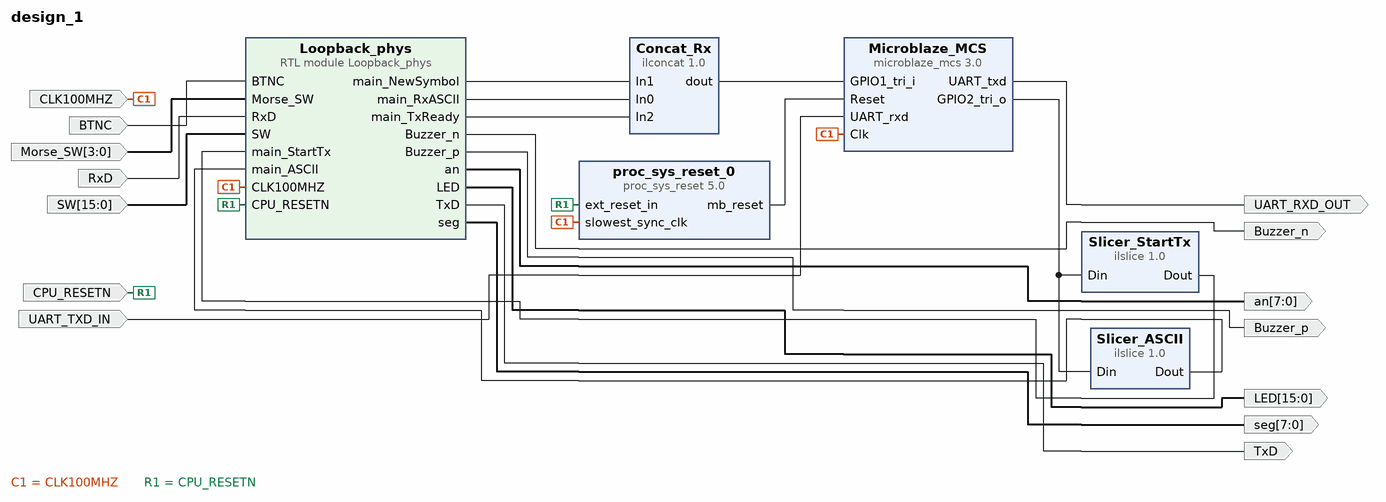
[diagram p0: block diagram of the top level]
# Vivado block design design_1, xc7a50ticsg324-1L, Vivado 2025.1
create_bd_design design_1

create_bd_port -dir I -type rst CPU_RESETN
set_property -dict {CONFIG.POLARITY ACTIVE_LOW} [get_bd_ports CPU_RESETN]
create_bd_port -dir I RxD
create_bd_port -dir O TxD
create_bd_port -dir I BTNC
create_bd_port -dir O Buzzer_p
create_bd_port -dir O Buzzer_n
create_bd_port -dir O -from 15 -to 0 LED
create_bd_port -dir O -from 7 -to 0 seg
create_bd_port -dir O -from 7 -to 0 an
create_bd_port -dir I -from 15 -to 0 SW
create_bd_port -dir I -from 3 -to 0 Morse_SW
create_bd_port -dir I UART_TXD_IN
create_bd_port -dir O UART_RXD_OUT
create_bd_port -dir I -type clk CLK100MHZ
set_property -dict {CONFIG.FREQ_HZ 100000000} [get_bd_ports CLK100MHZ]

create_bd_cell -type ip -vlnv xilinx.com:ip:microblaze_mcs:3.0 Microblaze_MCS
set_property -dict [list \
  CONFIG.GPI1_SIZE 10 \
  CONFIG.GPO2_SIZE 9 \
  CONFIG.MEMSIZE 131072 \
  CONFIG.RESET_BOARD_INTERFACE Custom \
  CONFIG.UART_BAUDRATE 115200 \
  CONFIG.UART_BOARD_INTERFACE Custom \
  CONFIG.USE_BOARD_FLOW true \
  CONFIG.USE_GPI1 1 \
  CONFIG.USE_GPI2 0 \
  CONFIG.USE_GPO1 0 \
  CONFIG.USE_GPO2 1 \
] [get_bd_cells Microblaze_MCS]
create_bd_cell -type module -reference Loopback_phys Loopback_phys
create_bd_cell -type inline_hdl -vlnv xilinx.com:inline_hdl:ilconcat:1.0 Concat_Rx
set_property -dict {CONFIG.IN0_WIDTH 8 CONFIG.NUM_PORTS 3} [get_bd_cells Concat_Rx]
create_bd_cell -type inline_hdl -vlnv xilinx.com:inline_hdl:ilslice:1.0 Slicer_StartTx
set_property -dict {CONFIG.DIN_TO 8 CONFIG.DIN_WIDTH 9} [get_bd_cells Slicer_StartTx]
create_bd_cell -type inline_hdl -vlnv xilinx.com:inline_hdl:ilslice:1.0 Slicer_ASCII
set_property -dict {CONFIG.DIN_FROM 7 CONFIG.DIN_WIDTH 9} [get_bd_cells Slicer_ASCII]
create_bd_cell -type ip -vlnv xilinx.com:ip:proc_sys_reset:5.0 proc_sys_reset_0
set_property -dict {CONFIG.RESET_BOARD_INTERFACE Custom CONFIG.USE_BOARD_FLOW true} [get_bd_cells proc_sys_reset_0]

# ---- connections ----

connect_bd_net [get_bd_ports BTNC] [get_bd_pins Loopback_phys/BTNC]
connect_bd_net [get_bd_ports CLK100MHZ] \
  [get_bd_pins proc_sys_reset_0/slowest_sync_clk] [get_bd_pins Microblaze_MCS/Clk] [get_bd_pins Loopback_phys/CLK100MHZ]
connect_bd_net [get_bd_ports CPU_RESETN] [get_bd_pins proc_sys_reset_0/ext_reset_in] [get_bd_pins Loopback_phys/CPU_RESETN]
connect_bd_net -net Loopback_phys_0_main_NewSymbol [get_bd_pins Loopback_phys/main_NewSymbol] [get_bd_pins Concat_Rx/In1]
connect_bd_net [get_bd_pins Loopback_phys/Buzzer_n] [get_bd_ports Buzzer_n]
connect_bd_net [get_bd_pins Loopback_phys/Buzzer_p] [get_bd_ports Buzzer_p]
connect_bd_net [get_bd_pins Loopback_phys/LED] [get_bd_ports LED]
connect_bd_net [get_bd_pins Loopback_phys/TxD] [get_bd_ports TxD]
connect_bd_net [get_bd_pins Loopback_phys/an] [get_bd_ports an]
connect_bd_net [get_bd_pins Loopback_phys/main_RxASCII] [get_bd_pins Concat_Rx/In0]
connect_bd_net [get_bd_pins Loopback_phys/main_TxReady] [get_bd_pins Concat_Rx/In2]
connect_bd_net [get_bd_pins Loopback_phys/seg] [get_bd_ports seg]
connect_bd_net [get_bd_pins Microblaze_MCS/UART_txd] [get_bd_ports UART_RXD_OUT]
connect_bd_net [get_bd_ports Morse_SW] [get_bd_pins Loopback_phys/Morse_SW]
connect_bd_net [get_bd_ports RxD] [get_bd_pins Loopback_phys/RxD]
connect_bd_net [get_bd_ports SW] [get_bd_pins Loopback_phys/SW]
connect_bd_net [get_bd_pins Slicer_ASCII/Dout] [get_bd_pins Loopback_phys/main_ASCII]
connect_bd_net [get_bd_pins Slicer_StartTx/Dout] [get_bd_pins Loopback_phys/main_StartTx]
connect_bd_net [get_bd_ports UART_TXD_IN] [get_bd_pins Microblaze_MCS/UART_rxd]
connect_bd_net -net ilconcat_0_dout [get_bd_pins Concat_Rx/dout] [get_bd_pins Microblaze_MCS/GPIO1_tri_i]
connect_bd_net -net microblaze_mcs_0_GPIO2_tri_o [get_bd_pins Microblaze_MCS/GPIO2_tri_o] \
  [get_bd_pins Slicer_StartTx/Din] [get_bd_pins Slicer_ASCII/Din]
connect_bd_net [get_bd_pins proc_sys_reset_0/mb_reset] [get_bd_pins Microblaze_MCS/Reset]

validate_bd_design
save_bd_design
